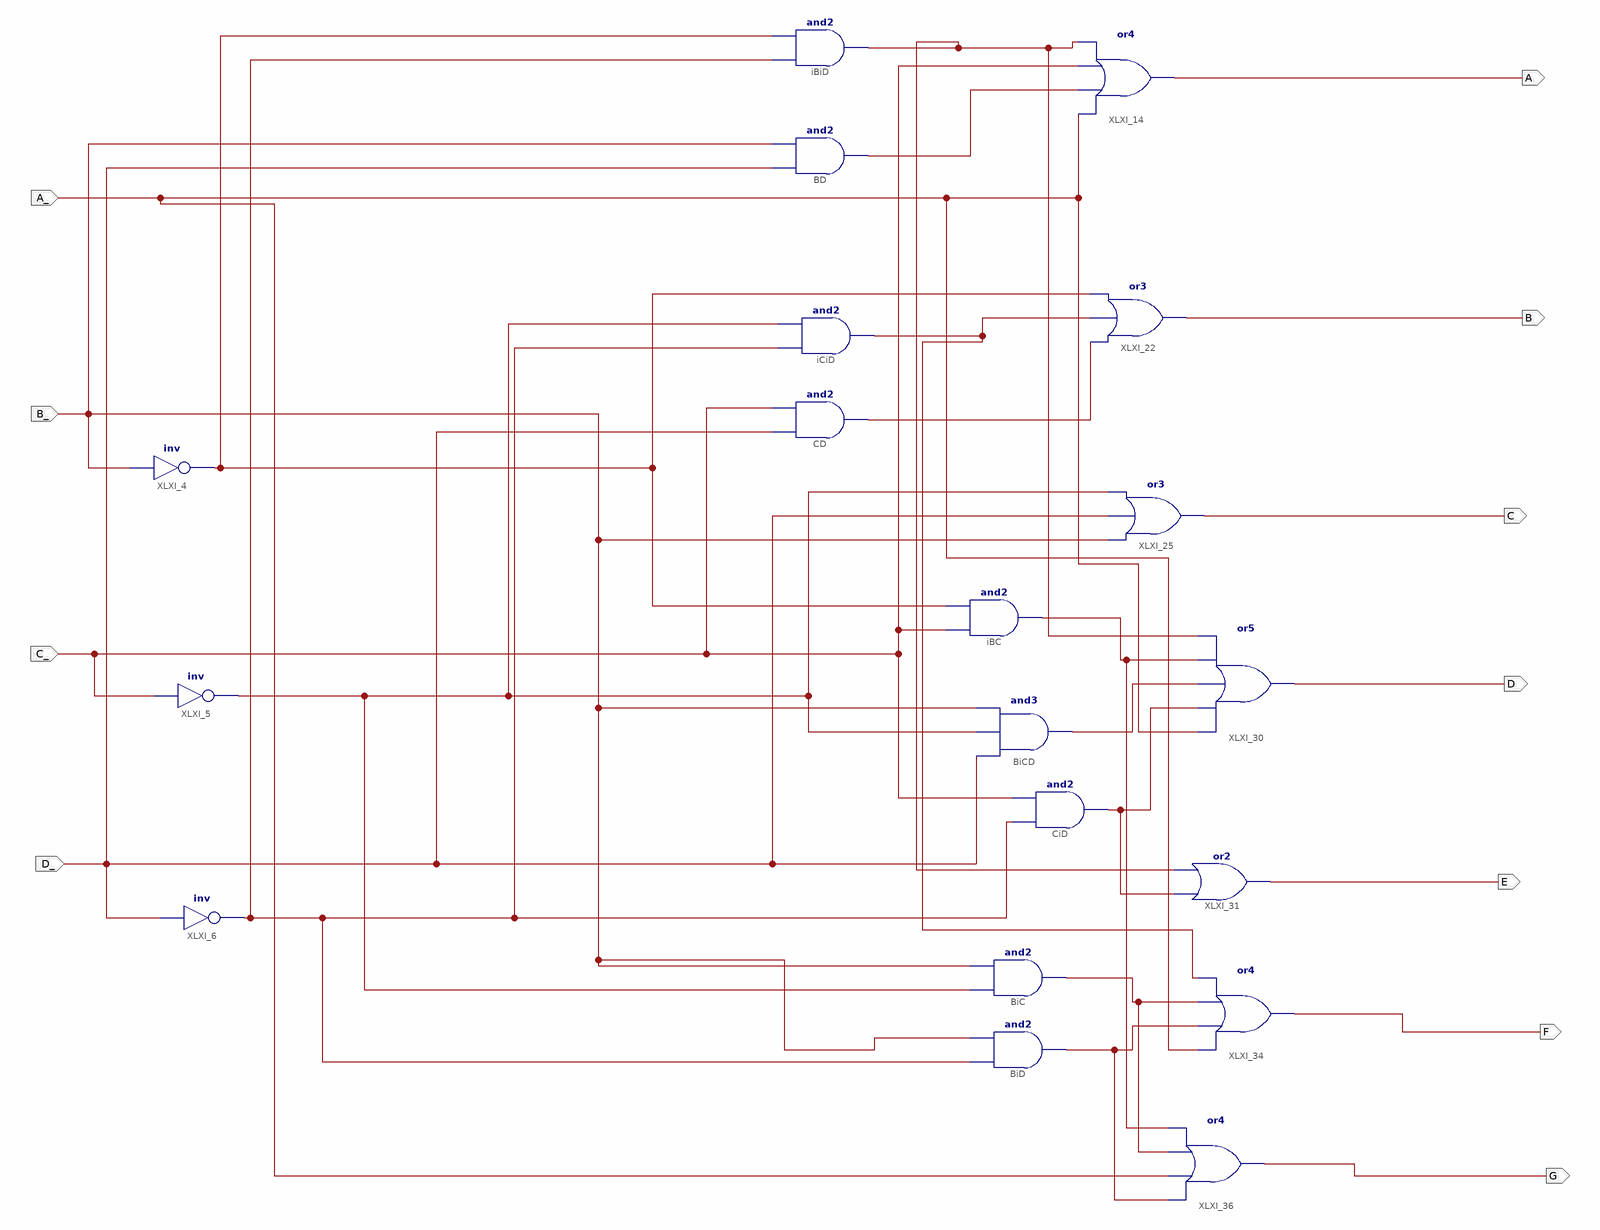
[diagram p0: schematic sheet 1]
// Xilinx ISE schematic bcdto7.sch (spartan6) as structural Verilog: 19 symbols, 11 ports
module bcdto7 (
  input  A_,
  input  B_,
  input  C_,
  input  D_,
  output D,
  output E,
  output F,
  output G,
  output C,
  output B,
  output A
);

  wire XLXN_35, XLXN_49, XLXN_74, XLXN_75, XLXN_77, XLXN_87, XLXN_88, XLXN_89, XLXN_91, XLXN_96, XLXN_101,
       XLXN_102;

  not XLXI_4 (XLXN_35, B_);
  not XLXI_5 (XLXN_74, C_);
  not XLXI_6 (XLXN_102, D_);
  and BD (XLXN_49, D_, B_);
  and iBiD (XLXN_87, XLXN_102, XLXN_35);
  or XLXI_14 (A, A_, XLXN_49, C_, XLXN_87);
  or XLXI_22 (B, XLXN_77, XLXN_75, XLXN_35);
  and iCiD (XLXN_75, XLXN_102, XLXN_74);
  and CD (XLXN_77, D_, C_);
  or XLXI_25 (C, B_, D_, XLXN_74);
  and iBC (XLXN_88, C_, XLXN_35);
  and BiCD (XLXN_89, D_, XLXN_74, B_);
  and CiD (XLXN_91, XLXN_102, C_);
  or XLXI_30 (D, A_, XLXN_91, XLXN_89, XLXN_88, XLXN_87);
  or XLXI_31 (E, XLXN_91, XLXN_87);
  and BiC (XLXN_96, XLXN_74, B_);
  and BiD (XLXN_101, XLXN_102, B_);
  or XLXI_34 (F, A_, XLXN_101, XLXN_96, XLXN_75);
  or XLXI_36 (G, XLXN_101, A_, XLXN_96, XLXN_88);
endmodule
